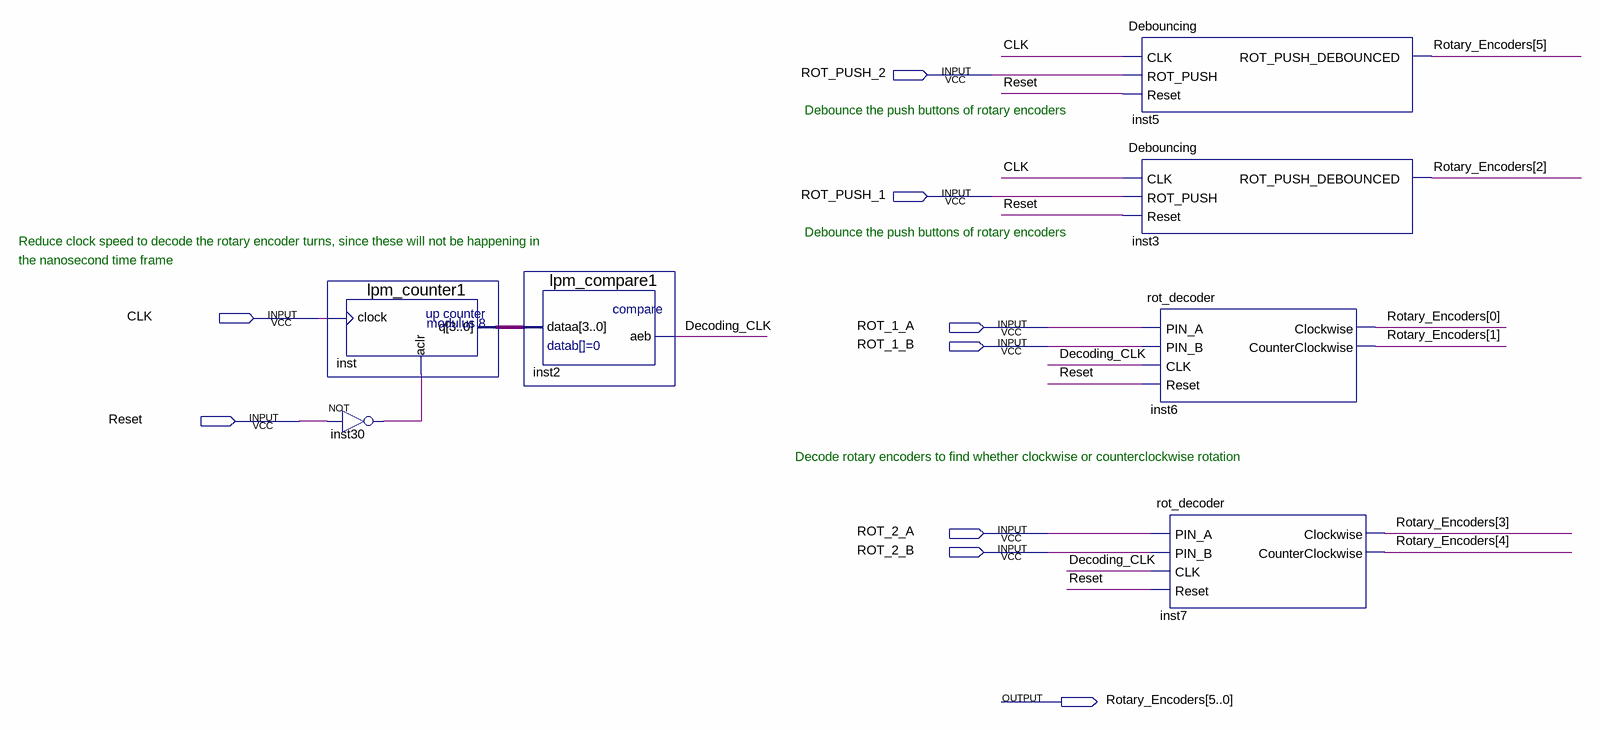
[diagram p0: schematic sheet]
// Quartus schematic Rotary_Encoders.bdf as structural Verilog: 7 symbols, 9 pins
module Rotary_Encoders (
  input  ROT_PUSH_2,
  input  ROT_PUSH_1,
  input  CLK,
  input  ROT_1_A,
  input  ROT_1_B,
  input  Reset,
  input  ROT_2_A,
  input  ROT_2_B,
  output [5:0] Rotary_Encoders
);

  wire Decoding_CLK, inst30_out;
  wire [3:0] inst_q;

  lpm_counter1 inst (.clock(CLK), .aclr(inst30_out), .q(inst_q));
  not inst30 (inst30_out, Reset);
  lpm_compare1 inst2 (.dataa(inst_q), .aeb(Decoding_CLK));
  Debouncing inst5 (.CLK(CLK), .ROT_PUSH(ROT_PUSH_2), .Reset(Reset), .ROT_PUSH_DEBOUNCED(Rotary_Encoders[5]));
  Debouncing inst3 (.CLK(CLK), .ROT_PUSH(ROT_PUSH_1), .Reset(Reset), .ROT_PUSH_DEBOUNCED(Rotary_Encoders[2]));
  rot_decoder inst6 (
    .PIN_A(ROT_1_A), .PIN_B(ROT_1_B), .CLK(Decoding_CLK), .Reset(Reset), .Clockwise(Rotary_Encoders[0]),
    .CounterClockwise(Rotary_Encoders[1]));
  rot_decoder inst7 (
    .PIN_A(ROT_2_A), .PIN_B(ROT_2_B), .CLK(Decoding_CLK), .Reset(Reset), .Clockwise(Rotary_Encoders[3]),
    .CounterClockwise(Rotary_Encoders[4]));

  // Notes on the sheet:
  //   Debounce the push buttons of rotary encoders
  //   Debounce the push buttons of rotary encoders
  //   Reduce clock speed to decode the rotary encoder turns, since these will not be happening in
  //   the nanosecond time frame
  //   Decode rotary encoders to find whether clockwise or counterclockwise rotation
endmodule
